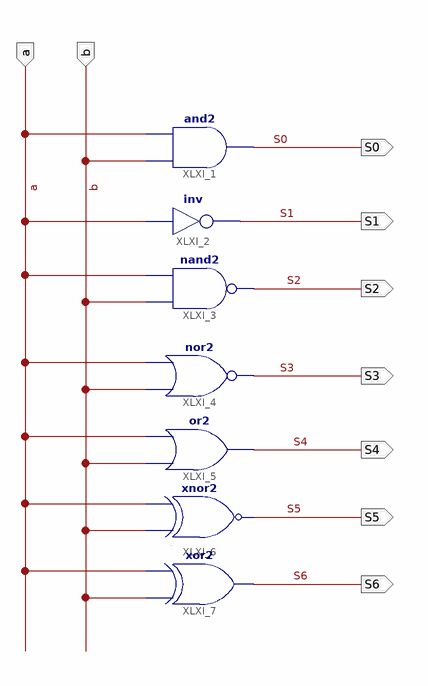
[diagram p0: schematic sheet 1]
// Xilinx ISE schematic firstch.sch (spartan3e) as structural Verilog: 7 symbols, 9 ports
module firstch (
  input  b,
  input  a,
  output S0,
  output S1,
  output S2,
  output S3,
  output S4,
  output S5,
  output S6
);

  and XLXI_1 (S0, b, a);
  not XLXI_2 (S1, a);
  nand XLXI_3 (S2, b, a);
  nor XLXI_4 (S3, b, a);
  or XLXI_5 (S4, b, a);
  xnor XLXI_6 (S5, b, a);
  xor XLXI_7 (S6, b, a);
endmodule
